# Altium schematic sheet GSH_Bed_mainboard.SchDoc
size A4; SheetNumber: 2; SheetTotal: 2
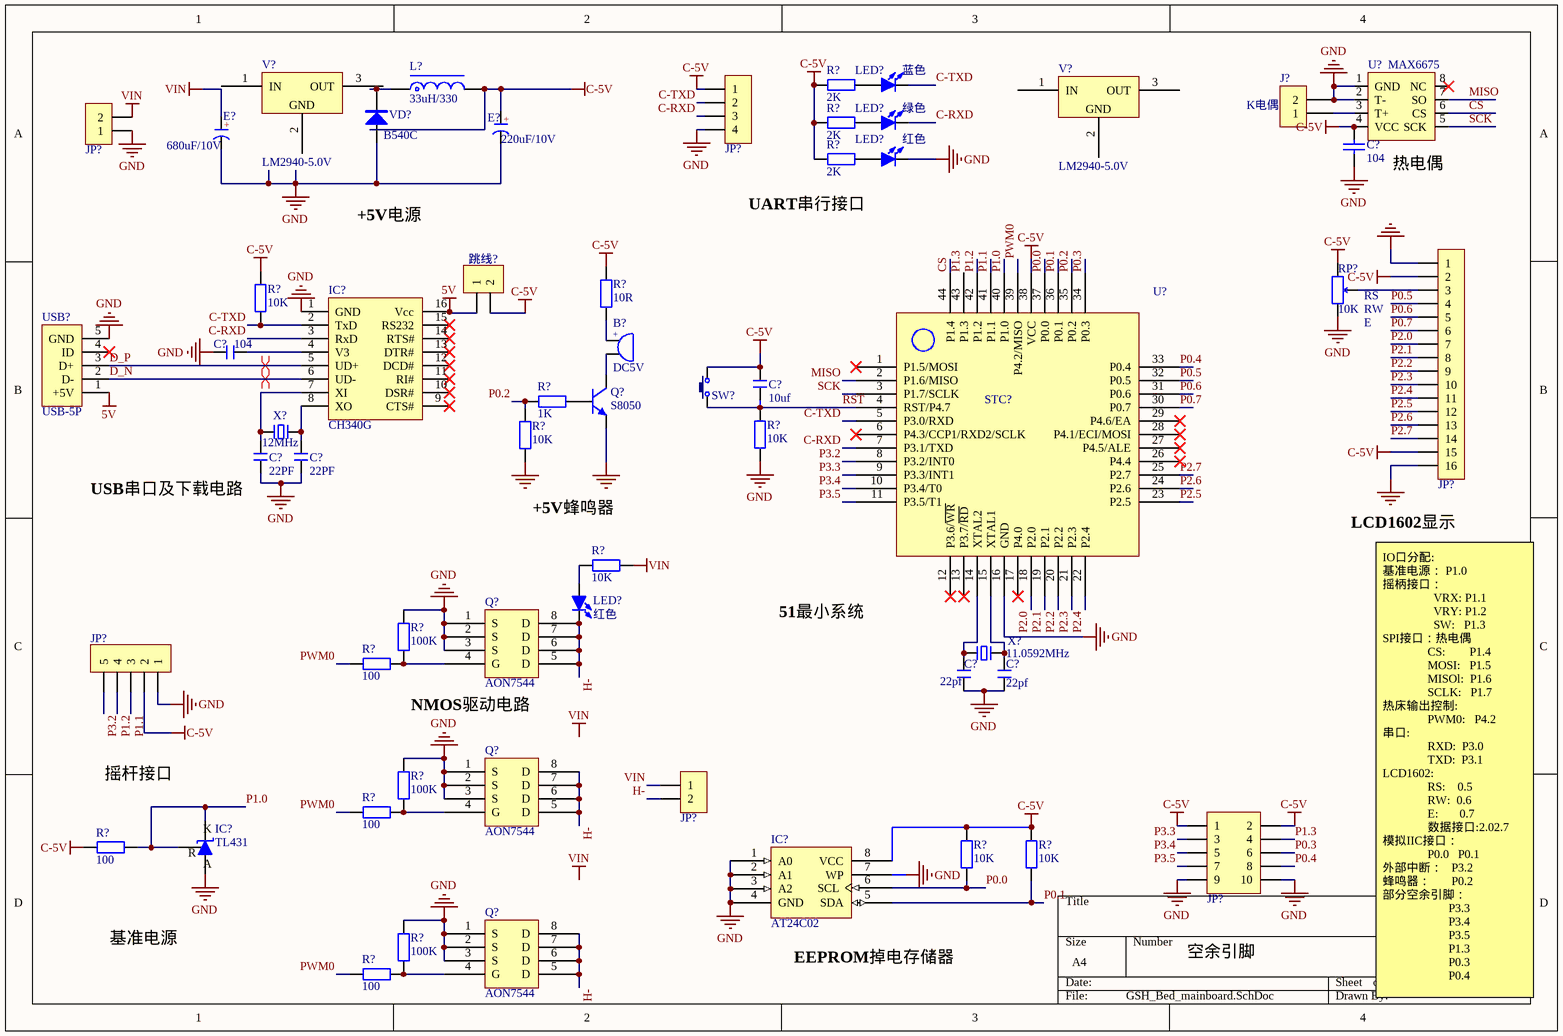
[diagram p0: GSH_Bed_mainboard.SchDoc]

## Parts
(Parts that share a designator on the sheet are numbered #1, #2 ... from top to bottom, then left to right.)
B?  DC5V  [Buzzer]
C?#1  104  [C 0603]
C?#2  104  [C 0603]
C?#3  10uf  [C 0603]
C?#4  22PF  [C 0603]
C?#5  22PF  [C 0603]
C?#6  22pf  [C 0603]
C?#7  22pf  [C 0603]
E?#1  680uF/10V  [CM F(10*10.2)]
E?#2  220uF/10V  [CM D(6.3*5.4)]
IC?#1  CH340G  [SOP16_N]
IC?#2  TL431  [SOT23-3L]
IC?#3  AT24C02  [SOP8_N]
J?  K电偶  [HDR-1x2]
JP?#1  HDR-1X4  [HDR-1X4]  (value not drawn)
JP?#2  HDR-1X2  [KF2EDGK5.0-2P]  (value not drawn)
JP?#3  HDR-1X16  [LCD-1602]  (value not drawn)
JP?#4  HDR-1X5  [XH2.54-5P]  (value not drawn)
JP?#5  HDR-1X2  [KF2EDGK5.0-2P]  (value not drawn)
JP?#6  Header 5X2  [HDR-5X2]  (value not drawn)
L?  33uH/330  [CDRH74]
LED?#1  蓝色  [LED 0603B]
LED?#2  绿色  [LED 0603G]
LED?#3  红色  [LED 3MM-R]
LED?#4  红色  [LED 3MM-R]
Q?#1  S8050  [SOT23-3N]
Q?#2  AON7544  [AON7544]
Q?#3  AON7544  [AON7544]
Q?#4  AON7544  [AON7544]
R?#1  2K  [R 0603-HP]
R?#2  2K  [R 0603-HP]
R?#3  2K  [R 0603-HP]
R?#4  10K  [R 0603-HP]
R?#5  10R  [R 0603-HP]
R?#6  1K  [R 0603-HP]
R?#7  10K  [R 0603-HP]
R?#8  10K  [R 0603-HP]
R?#9  10K  [R 0603-HP]
R?#10  100  [R 0603-HP]
R?#11  100K  [R 0603-HP]
R?#12  100  [R 0603-HP]
R?#13  100K  [R 0603-HP]
R?#14  100  [R 0603-HP]
R?#15  10K  [R 0603-HP]
R?#16  10K  [R 0603-HP]
R?#17  100  [R 0603-HP]
R?#18  100K  [R 0603-HP]
RP?  10K  [RM065]
STC?  U?  [LQFP44 10X10_L]
SW?  3x6x5  [TSW SMD-3*6*2.5]  (value not drawn)
U?  MAX6675  [SOP8_L]
USB?  USB-5P  [USB-MICRO_A]
V?#1  LM2940-5.0V  [TO252]
V?#2  LM2940-5.0V  [TO252]
VD?  B540C  [SMC]
X?#1  12MHz  [XTAL-49S DIP]
X?#2  11.0592MHz  [XTAL-49S DIP]
跳线?  HDR-1X2  [HDR-1X2]  (value not drawn)

## Nets
5V: IC?#1.16(Vcc) USB?.1(+5V) 跳线?.1
C-5V: C?#1.2 C?#3.2 E?#2.1(A) IC?#3.8(VCC) JP?#1.1 JP?#3.2 JP?#3.15 JP?#4.2 JP?#6.1 JP?#6.2 L?.2 R?#1.2 R?#2.2 R?#3.2 R?#4.2 R?#5.2 R?#14.2 R?#15.2 R?#16.2 RP?.3 STC?.38(VCC) SW?.2 U?.4(VCC) 跳线?.2
GND: C?#1.1 C?#2.1 C?#4.2 C?#5.2 C?#6.1 C?#7.1 E?#1.2(K) E?#2.2(K) IC?#1.1(GND) IC?#2.2(A) IC?#3.1(A0) IC?#3.2(A1) IC?#3.3(A2) IC?#3.4(GND) IC?#3.7(WP) J?.2 JP?#1.4 JP?#2.1 JP?#3.1 JP?#3.16 JP?#4.1 JP?#6.9 JP?#6.10 LED?#3.2(K) Q?#1.2(E) Q?#2.1(S) Q?#2.2(S) Q?#2.3(S) Q?#3.1(S) Q?#3.2(S) Q?#3.3(S) Q?#4.1(S) Q?#4.2(S) Q?#4.3(S) R?#7.1 R?#8.1 R?#11.2 R?#13.2 R?#18.2 RP?.1 STC?.16(GND) U?.1(GND) U?.2(T-) USB?.5(GND) VD?.1(A)
VIN: E?#1.1(A) JP?#2.2 JP?#5.1 R?#9.2
C-RXD: IC?#1.3(RxD) JP?#1.3 LED?#2.2(K) STC?.7(P3.1/TXD)
C-TXD: IC?#1.2(TxD) JP?#1.2 LED?#1.2(K) R?#4.1 STC?.5(P3.0/RXD)
CS: STC?.44(P1.4) U?.6(CS)
D_N: IC?#1.6(UD-) USB?.2(D-)
D_P: IC?#1.5(UD+) USB?.3(D+)
H-: JP?#5.2 LED?#4.2(K) Q?#2.5(D) Q?#2.6(D) Q?#2.7(D) Q?#2.8(D) Q?#3.5(D) Q?#3.6(D) Q?#3.7(D) Q?#3.8(D) Q?#4.5(D) Q?#4.6(D) Q?#4.7(D) Q?#4.8(D)
MISO: STC?.2(P1.6/MISO) U?.7(SO)
P0.0: IC?#3.6(SCL) R?#15.1 STC?.37(P0.0)
P0.1: IC?#3.5(SDA) R?#16.1 STC?.36(P0.1)
P0.2: R?#6.1 R?#7.2 STC?.35(P0.2)
P0.3: JP?#6.6 STC?.34(P0.3)
P0.4: JP?#6.8 STC?.33(P0.4)
P0.5: JP?#3.4 STC?.32(P0.5)
P0.6: JP?#3.5 STC?.31(P0.6)
P0.7: JP?#3.6 STC?.30(P0.7)
P1.0: IC?#2.1(R) IC?#2.3(K) R?#14.1 STC?.40(P1.0)
P1.1: JP?#4.3 STC?.41(P1.1)
P1.2: JP?#4.4 STC?.42(P1.2)
P1.3: JP?#6.4 STC?.43(P1.3)
P2.0: JP?#3.7 STC?.18(P2.0)
P2.1: JP?#3.8 STC?.19(P2.1)
P2.2: JP?#3.9 STC?.20(P2.2)
P2.3: JP?#3.10 STC?.21(P2.3)
P2.4: JP?#3.11 STC?.22(P2.4)
P2.5: JP?#3.12 STC?.23(P2.5)
P2.6: JP?#3.13 STC?.24(P2.6)
P2.7: JP?#3.14 STC?.25(P2.7)
P3.2: JP?#4.5 STC?.8(P3.2/INT0)
P3.3: JP?#6.3 STC?.9(P3.3/INT1)
P3.4: JP?#6.5 STC?.10(P3.4/T0)
P3.5: JP?#6.7 STC?.11(P3.5/T1)
PWM0: R?#10.1 R?#12.1 R?#17.1 STC?.39(P4.2/MISO)
RST: C?#3.1 R?#8.2 STC?.4(RST/P4.7) SW?.1
SCK: STC?.3(P1.7/SCLK) U?.5(SCK)
NetB?_1: B?.1 R?#5.1
NetB?_2: B?.2 Q?#1.3(C)
NetC?#2_2: C?#2.2 IC?#1.4(V3)
NetC?#4_1: C?#4.1 IC?#1.7(XI) X?#1.1
NetC?#5_1: C?#5.1 IC?#1.8(XO) X?#1.2
NetC?#6_2: C?#6.2 STC?.14(XTAL2) X?#2.2
NetC?#7_2: C?#7.2 STC?.15(XTAL1) X?#2.1
NetJ?_1: J?.1 U?.3(T+)
NetJP?#3_3: JP?#3.3 RP?.2
NetL?_1: L?.1 VD?.2(K)
NetLED?#1_1: LED?#1.1(A) R?#1.1
NetLED?#2_1: LED?#2.1(A) R?#2.1
NetLED?#3_1: LED?#3.1(A) R?#3.1
NetLED?#4_1: LED?#4.1(A) R?#9.1
NetQ?#1_1: Q?#1.1(B) R?#6.2
NetQ?#2_4: Q?#2.4(G) R?#10.2 R?#11.1
NetQ?#3_4: Q?#3.4(G) R?#12.2 R?#13.1
NetQ?#4_4: Q?#4.4(G) R?#17.2 R?#18.1

Not connected (* = marked no-connect by the designer): IC?#1 9(CTS#)* 10(DSR#)* 11(RI#)* 12(DCD#)* 13(DTR#)* 14(RTS#)* 15(RS232)*; STC? 1(P1.5/MOSI)* 6(P4.3/CCP1/RXD2/SCLK)* 12(P3.6/~{WR})* 13(P3.7/~{RD})* 17(P4.0)* 26(P4.4)* 27(P4.5/ALE)* 28(P4.1/ECI/MOSI)* 29(P4.6/EA)*; U? 8(NC)*; USB? 4(ID)*; V?#1 1(IN) 2(GND) 3(OUT); V?#2 1(IN) 2(GND) 3(OUT)

## Layout directives
differential pair: D_N, D_P

## Notes on the sheet
- (near U?) 热电偶
- +5V电源
- UART串行接口
- (near RP?) RS
- (near RP?) RW
- (near RP?) E
- USB串口及下载电路
- (near R?#9) +5V蜂鸣器
- (near JP?#3) LCD1602显示
- 51最小系统
- (near Q?#2) NMOS驱动电路
- 摇杆接口
- 基准电源
- (near IC?#3) EEPROM掉电存储器
- 空余引脚
- IO口分配:
  基准电源： P1.0
  摇柄接口：
  VRX: P1.1
  VRY: P1.2
  SW:   P1.3
  SPI接口：热电偶
  CS:        P1.4
  MOSI:   P1.5
  MISOl:  P1.6
  SCLK:   P1.7
  热床输出控制:
  PWM0:   P4.2
  串口:
  RXD:  P3.0
  TXD:  P3.1
  LCD1602:
  RS:    0.5
  RW:  0.6
  E:       0.7
  数据接口:2.02.7
  模拟IIC接口：
  P0.0   P0.1
  外部中断：   P3.2
  蜂鸣器：       P0.2
  部分空余引脚：
  P3.3
  P3.4
  P3.5
  P1.3
  P0.3
  P0.4
- Labels drawn without touching a wire or pin: VIN
- (in symbol BEEP) +
- (in symbol C-CM) +

## Library data of the parts
B? = BEEP: 蜂鸣器; 版权归属: 源创客; BOM名称: 蜂鸣器; 学习资源: www.ooocke.com
C?#1 = Cap: Capacitor; Value: 100pF; Published: 8-Jun-2000; LatestRevisionDate: 17-Jul-2002; LatestRevisionNote: Re-released for DXP Platform.; PackageReference: RAD-0.3; Publisher: Altium Limited
C?#2-C?#7 = C: 无极性贴片电容; 版权归属: 源创客; BOM名称: 无极性贴片电容; 学习资源: www.ooocke.com
E?#1 E?#2 = C-CM: 贴片电解电容; 版权归属: 源创客; BOM名称: 贴片电解电容; 学习资源: www.ooocke.com
IC?#1 = CH340G: 串口转USB; 版权归属: 源创客; BOM名称: 串口转USB; 学习资源: www.ooocke.com
IC?#2 = TL431-ID: 可调基准稳压芯片; 版权归属: 源创客; BOM名称: 可调基准稳压芯片; 学习资源: www.ooocke.com
IC?#3 = 24Cxx: 外置EEPROM; 版权归属: 源创客; BOM名称: 外置EEPROM; 学习资源: www.ooocke.com
J? = CON2: Connector
JP?#1 = Header 4: 4P接插件; 版权归属: 源创客; BOM名称: 4P接插件; 学习资源: www.ooocke.com
JP?#2 JP?#5 跳线? = Header 2: 2P接插件; 版权归属: 源创客; BOM名称: 2P接插件; 学习资源: www.ooocke.com
JP?#3 = Header 16: 16P接插件; 版权归属: 源创客; BOM名称: 16P接插件; 学习资源: www.ooocke.com
JP?#4 = Header 5: 5P接插件; 版权归属: 源创客; BOM名称: 5P接插件; 学习资源: www.ooocke.com
JP?#6 = Header 5X2: 5*2P接插件; 版权归属: 源创客; BOM名称: 5*2P接插件; 学习资源: www.ooocke.com
L? = L-CDRH: 功率屏蔽电感; 版权归属: 源创客; BOM名称: 功率屏蔽电感; 学习资源: www.ooocke.com
LED?#1-LED?#4 = LED-SMD: 贴片LED; 版权归属: 源创客; BOM名称: 贴片LED; 学习资源: www.ooocke.com
Q?#1 = 8050-SMD: 高频放大-NPN型; 版权归属: 源创客; 属性: 40V 1.5A 1W 100MHZ; BOM名称: 高频放大-NPN型; 学习资源: www.ooocke.com
Q?#2-Q?#4 = AON7544: n-mos
R?#1-R?#18 = R: 贴片电阻; 版权归属: 源创客; BOM名称: 贴片电阻; 学习资源: www.ooocke.com
RP? = RP-ID: 插件单联电位器; BOM名称: 插件电位器; 版权归属: 源创客; 学习资源: www.ooocke.com
SW? = TSW 3x6: 3x6轻触开关; 版权归属: 源创客; BOM名称: 3x6轻触开关; 学习资源: www.ooocke.com
U? = MAX6675: K电偶转换
USB? = USB-5P: 微型USB母座; 版权归属: 源创客; BOM名称: 微型USB母座; 学习资源: www.ooocke.com
V?#1 V?#2 = LM2940: 5V稳压芯片; 版权归属: 源创客; BOM名称: 5V稳压芯片; 学习资源: www.ooocke.com
VD? = SS34: 肖特基二极管; 版权归属: 源创客; 属性: 40V/3A; BOM名称: 肖特基二极管; 学习资源: www.ooocke.com
X?#1 X?#2 = XTAL-2: 2脚晶振; 版权归属: 源创客; BOM名称: 2脚晶振; 学习资源: www.ooocke.com